# Altium schematic sheet 电源2.0.SchDoc
size A4
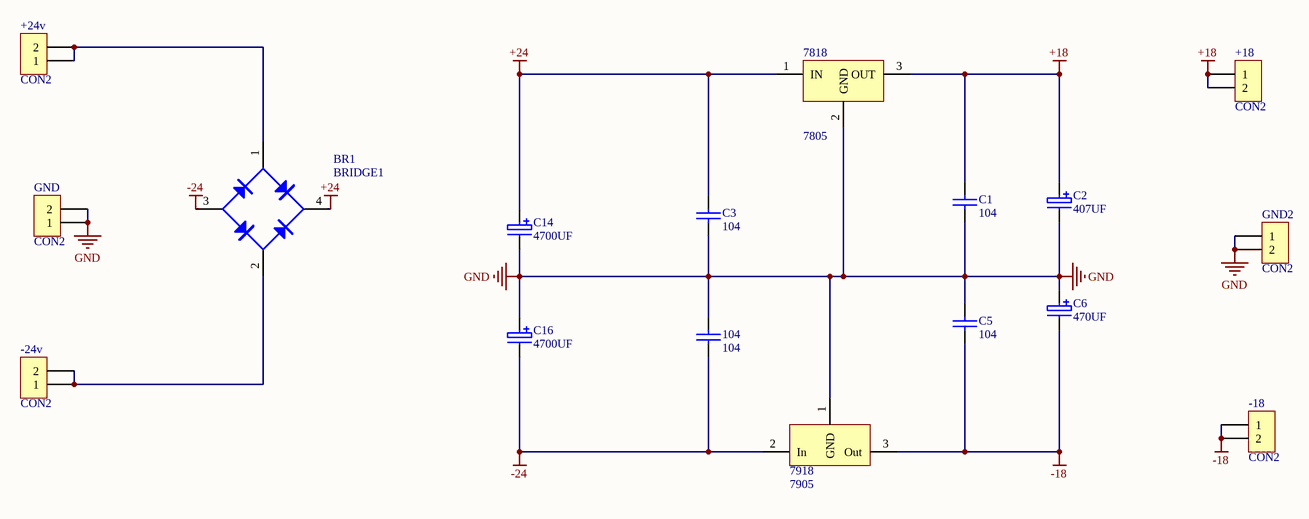
[diagram p0: 电源2.0.SchDoc]

## Parts
104  104  [CAP2]
7818  7805  [TO-220]
7918  7905  [TO-220]
+18  CON2  [2P-200]
+24v  CON2  [2P-200]
-18  CON2  [2P-200]
-24v  CON2  [2P-200]
BR1  BRIDGE1  [D3]
C1  104  [CAP2]
C2  407UF  [CAO5]
C3  104  [CAP2]
C5  104  [CAP2]
C6  470UF  [CAO5]
C14  4700UF  [C22]
C16  4700UF  [C22]
GND  CON2  [2P-200]
GND2  CON2  [2P-200]

## Nets
+18: 7818.3(OUT) +18.1 +18.2 C1.1 C2.1
+24: 7818.1(IN) BR1.4(V+) C3.1 C14.1
-18: 7918.3(Out) -18.1 -18.2 C5.2 C6.2
-24: 104.2 7918.2(In) BR1.3(V-) C16.2
GND: 104.1 7818.2(GND) 7918.1(GND) C1.2 C2.2 C3.2 C5.1 C6.1 C14.2 C16.1 GND.1 GND.2 GND2.1 GND2.2
Net+24v_1: +24v.1 +24v.2 BR1.1(AC1)
Net-24v_1: -24v.1 -24v.2 BR1.2(AC2)

## Library data of the parts
104 C1 C3 C5 = CAP1
+18 +24v -18 -24v GND GND2 = CON2: Connector
BR1 = BRIDGE1: BR
C2 C6 C14 C16 = CAP3